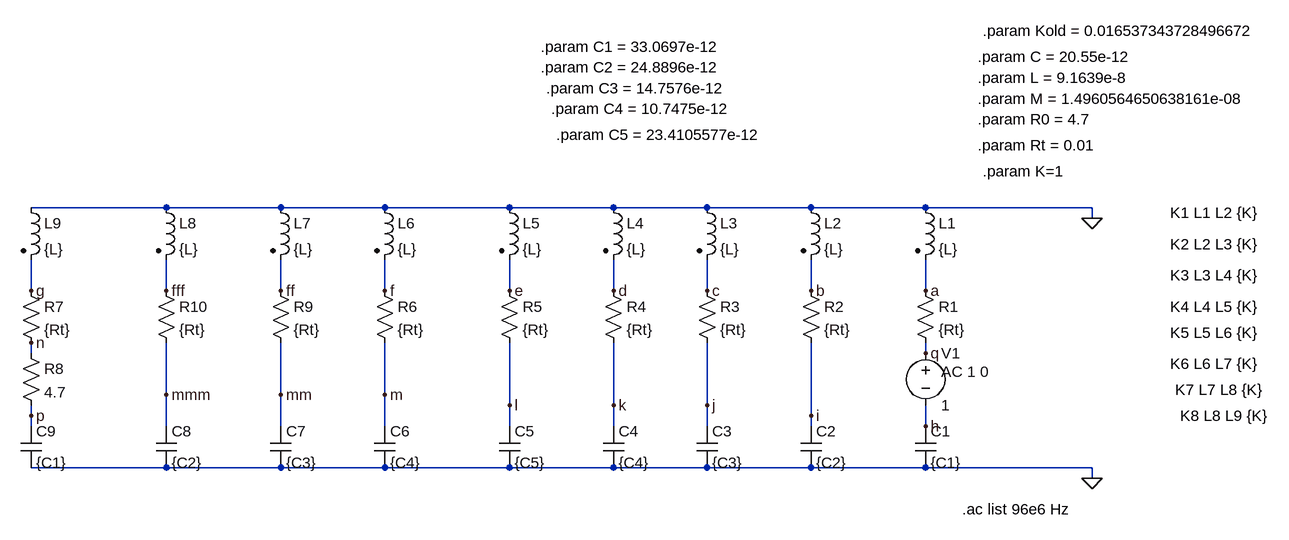
[diagram p0: schematic TWA_different_caps.asc]
TWA_different_caps.asc, the LTspice schematic file:
Version 4
SHEET 1 944 680
WIRE -976 -1504 -1184 -1504
WIRE -800 -1504 -976 -1504
WIRE -640 -1504 -800 -1504
WIRE -448 -1504 -640 -1504
WIRE -288 -1504 -448 -1504
WIRE -144 -1504 -288 -1504
WIRE 16 -1504 -144 -1504
WIRE 192 -1504 16 -1504
WIRE 448 -1504 192 -1504
WIRE 448 -1488 448 -1504
WIRE -1184 -1376 -1184 -1424
WIRE -976 -1376 -976 -1424
WIRE -800 -1376 -800 -1424
WIRE -640 -1376 -640 -1424
WIRE -448 -1376 -448 -1424
WIRE -288 -1376 -288 -1424
WIRE -144 -1376 -144 -1424
WIRE 16 -1376 16 -1424
WIRE 192 -1376 192 -1424
WIRE -1184 -1280 -1184 -1296
WIRE 192 -1280 192 -1296
WIRE -976 -1216 -976 -1296
WIRE -800 -1216 -800 -1296
WIRE -640 -1216 -640 -1296
WIRE -448 -1200 -448 -1296
WIRE -288 -1200 -288 -1296
WIRE -144 -1200 -144 -1296
WIRE -1184 -1184 -1184 -1200
WIRE 16 -1184 16 -1296
WIRE -1184 -1168 -1184 -1184
WIRE -976 -1168 -976 -1216
WIRE -800 -1168 -800 -1216
WIRE -640 -1168 -640 -1216
WIRE -448 -1168 -448 -1200
WIRE -288 -1168 -288 -1200
WIRE -144 -1168 -144 -1200
WIRE 16 -1168 16 -1184
WIRE 192 -1168 192 -1200
WIRE -976 -1104 -1184 -1104
WIRE -800 -1104 -976 -1104
WIRE -640 -1104 -800 -1104
WIRE -448 -1104 -640 -1104
WIRE -288 -1104 -448 -1104
WIRE -144 -1104 -288 -1104
WIRE 16 -1104 -144 -1104
WIRE 192 -1104 16 -1104
WIRE 448 -1104 192 -1104
WIRE 448 -1088 448 -1104
FLAG 448 -1088 0
FLAG 448 -1488 0
FLAG 192 -1376 a
FLAG 16 -1376 b
FLAG -144 -1376 c
FLAG -288 -1376 d
FLAG -448 -1376 e
FLAG -640 -1376 f
FLAG -1184 -1376 g
FLAG 192 -1168 h
FLAG 16 -1184 i
FLAG -144 -1200 j
FLAG -288 -1200 k
FLAG -448 -1200 l
FLAG -640 -1216 m
FLAG -1184 -1296 n
FLAG -1184 -1184 p
FLAG 192 -1280 q
FLAG -800 -1376 ff
FLAG -800 -1216 mm
FLAG -976 -1376 fff
FLAG -976 -1216 mmm
SYMBOL cap 176 -1168 R0
SYMATTR InstName C1
SYMATTR Value {C1}
SYMBOL res 176 -1392 R0
SYMATTR InstName R1
SYMATTR Value {Rt}
SYMBOL ind2 176 -1520 R0
SYMATTR InstName L1
SYMATTR Value {L}
SYMATTR Type ind
SYMATTR SpiceLine Rser=0
SYMBOL cap 0 -1168 R0
SYMATTR InstName C2
SYMATTR Value {C2}
SYMBOL res 0 -1392 R0
SYMATTR InstName R2
SYMATTR Value {Rt}
SYMBOL ind2 0 -1520 R0
SYMATTR InstName L2
SYMATTR Value {L}
SYMATTR Type ind
SYMATTR SpiceLine Rser=0
SYMBOL cap -160 -1168 R0
SYMATTR InstName C3
SYMATTR Value {C3}
SYMBOL res -160 -1392 R0
SYMATTR InstName R3
SYMATTR Value {Rt}
SYMBOL ind2 -160 -1520 R0
SYMATTR InstName L3
SYMATTR Value {L}
SYMATTR Type ind
SYMATTR SpiceLine Rser=0
SYMBOL cap -304 -1168 R0
SYMATTR InstName C4
SYMATTR Value {C4}
SYMBOL res -304 -1392 R0
SYMATTR InstName R4
SYMATTR Value {Rt}
SYMBOL ind2 -304 -1520 R0
SYMATTR InstName L4
SYMATTR Value {L}
SYMATTR Type ind
SYMATTR SpiceLine Rser=0
SYMBOL cap -464 -1168 R0
SYMATTR InstName C5
SYMATTR Value {C5}
SYMBOL res -464 -1392 R0
SYMATTR InstName R5
SYMATTR Value {Rt}
SYMBOL ind2 -464 -1520 R0
SYMATTR InstName L5
SYMATTR Value {L}
SYMATTR Type ind
SYMATTR SpiceLine Rser=0
SYMBOL cap -656 -1168 R0
SYMATTR InstName C6
SYMATTR Value {C4}
SYMBOL res -656 -1392 R0
SYMATTR InstName R6
SYMATTR Value {Rt}
SYMBOL ind2 -656 -1520 R0
SYMATTR InstName L6
SYMATTR Value {L}
SYMATTR Type ind
SYMATTR SpiceLine Rser=0
SYMBOL cap -1200 -1168 R0
SYMATTR InstName C9
SYMATTR Value {C1}
SYMBOL res -1200 -1392 R0
SYMATTR InstName R7
SYMATTR Value {Rt}
SYMBOL ind2 -1200 -1520 R0
SYMATTR InstName L9
SYMATTR Value {L}
SYMATTR Type ind
SYMATTR SpiceLine Rser=0
SYMBOL res -1200 -1296 R0
SYMATTR InstName R8
SYMATTR Value 4.7
SYMBOL voltage 192 -1296 R0
WINDOW 123 24 44 Left 2
WINDOW 39 0 0 Left 0
SYMATTR Value2 AC 1 0
SYMATTR InstName V1
SYMATTR Value 1
SYMBOL cap -816 -1168 R0
SYMATTR InstName C7
SYMATTR Value {C3}
SYMBOL res -816 -1392 R0
SYMATTR InstName R9
SYMATTR Value {Rt}
SYMBOL ind2 -816 -1520 R0
SYMATTR InstName L7
SYMATTR Value {L}
SYMATTR Type ind
SYMATTR SpiceLine Rser=0
SYMBOL cap -992 -1168 R0
SYMATTR InstName C8
SYMATTR Value {C2}
SYMBOL res -992 -1392 R0
SYMATTR InstName R10
SYMATTR Value {Rt}
SYMBOL ind2 -992 -1520 R0
SYMATTR InstName L8
SYMATTR Value {L}
SYMATTR Type ind
SYMATTR SpiceLine Rser=0
TEXT 272 -1736 Left 2 !.param C = 20.55e-12
TEXT 272 -1704 Left 2 !.param L = 9.1639e-8
TEXT 272 -1672 Left 2 !.param M = 1.4960564650638161e-08
TEXT 272 -1640 Left 2 !.param R0 = 4.7
TEXT 272 -1600 Left 2 !.param Rt = 0.01
TEXT 568 -1496 Left 2 !K1 L1 L2 {K}
TEXT 280 -1560 Left 2 !.param K=1
TEXT 568 -1448 Left 2 !K2 L2 L3 {K}
TEXT 568 -1400 Left 2 !K3 L3 L4 {K}
TEXT 568 -1352 Left 2 !K4 L4 L5 {K}
TEXT 568 -1312 Left 2 !K5 L5 L6 {K}
TEXT 568 -1264 Left 2 !K6 L6 L7 {K}
TEXT 248 -1040 Left 2 !.ac list 96e6 Hz
TEXT -400 -1752 Left 2 !.param C1 = 33.0697e-12
TEXT -400 -1720 Left 2 !.param C2 = 24.8896e-12
TEXT -392 -1688 Left 2 !.param C3 = 14.7576e-12
TEXT -384 -1656 Left 2 !.param C4 = 10.7475e-12
TEXT -376 -1616 Left 2 !.param C5 = 23.4105577e-12
TEXT 576 -1224 Left 2 !K7 L7 L8 {K}
TEXT 584 -1184 Left 2 !K8 L8 L9 {K}
TEXT 280 -1776 Left 2 !.param Kold = 0.016537343728496672

The netlist it stands for:
* TWA_different_caps.asc
C1 h 0 {C1}
R1 a q {Rt}
L1 0 a {L} Rser=0
C2 i 0 {C2}
R2 b i {Rt}
L2 0 b {L} Rser=0
C3 j 0 {C3}
R3 c j {Rt}
L3 0 c {L} Rser=0
C4 k 0 {C4}
R4 d k {Rt}
L4 0 d {L} Rser=0
C5 l 0 {C5}
R5 e l {Rt}
L5 0 e {L} Rser=0
C6 m 0 {C4}
R6 f m {Rt}
L6 0 f {L} Rser=0
C9 p 0 {C1}
R7 g n {Rt}
L9 0 g {L} Rser=0
R8 n p 4.7
V1 q h 1 AC 1 0
C7 mm 0 {C3}
R9 ff mm {Rt}
L7 0 ff {L} Rser=0
C8 mmm 0 {C2}
R10 fff mmm {Rt}
L8 0 fff {L} Rser=0
.param C = 20.55e-12
.param L = 9.1639e-8
.param M = 1.4960564650638161e-08
.param R0 = 4.7
.param Rt = 0.01
K1 L1 L2 {K}
.param K=1
K2 L2 L3 {K}
K3 L3 L4 {K}
K4 L4 L5 {K}
K5 L5 L6 {K}
K6 L6 L7 {K}
.ac list 96e6 Hz
.param C1 = 33.0697e-12
.param C2 = 24.8896e-12
.param C3 = 14.7576e-12
.param C4 = 10.7475e-12
.param C5 = 23.4105577e-12
K7 L7 L8 {K}
K8 L8 L9 {K}
.param Kold = 0.016537343728496672
.backanno
.end

* Results of the author's LTspice run, read from the files saved beside the schematic
* AC Analysis:
*   frequency = 96 M
*   V(h) = -1.339 V
*   V(a) = -338.8 mV
*   V(q) = -338.8 mV
*   V(i) = 1.371 V
*   V(b) = 1.371 V
*   V(j) = 3.474 V
*   V(c) = 3.474 V
*   V(k) = 1.751 V
*   V(d) = 1.751 V
*   V(l) = -750.7 mV
*   V(e) = -750.7 mV
*   V(m) = -2.21 V
*   V(f) = -2.21 V
*   V(p) = 742.4 mV
*   V(g) = 751.3 mV
*   V(n) = 751.3 mV
*   V(mm) = -1.692 V
*   V(ff) = -1.692 V
*   V(mmm) = -81.06 mV
*   V(fff) = -81.07 mV
*   I(C1) = -1.078 mA
*   I(C2) = 105.1 µA
*   I(C3) = 1.095 mA
*   I(C4) = 1.02 mA
*   I(C5) = 729.3 µA
*   I(C6) = -813.1 µA
*   I(C9) = 1.888 mA
*   I(C7) = -2.183 mA
*   I(C8) = -1.438 mA
*   I(L1) = -1.078 mA
*   I(L2) = 105.1 µA
*   I(L3) = 1.095 mA
*   I(L4) = 1.02 mA
*   I(L5) = 729.3 µA
*   I(L6) = -813.1 µA
*   I(L9) = 1.888 mA
*   I(L7) = -2.183 mA
*   I(L8) = -1.438 mA
*   I(R1) = -1.078 mA
*   I(R2) = 105.1 µA
*   I(R3) = 1.095 mA
*   I(R4) = 1.02 mA
*   I(R5) = 729.3 µA
*   I(R6) = -813.1 µA
*   I(R7) = 1.888 mA
*   I(R8) = 1.888 mA
*   I(R9) = -2.183 mA
*   I(R10) = -1.438 mA
*   I(V1) = -1.078 mA